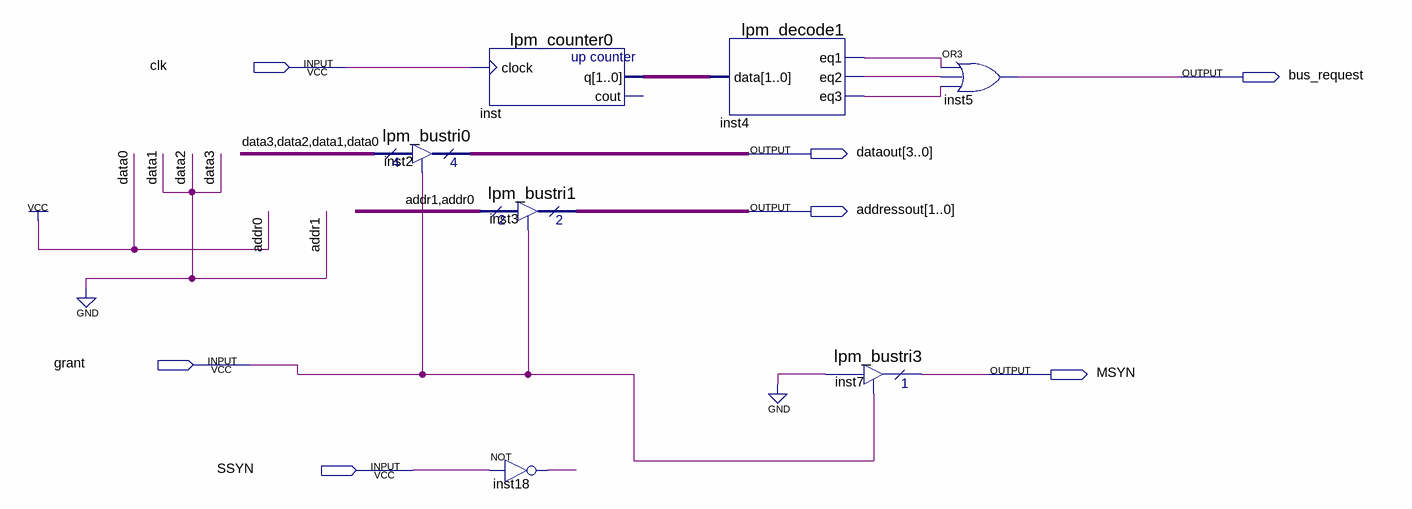
[diagram p0: schematic sheet]
// Quartus schematic master1.bdf as structural Verilog: 7 symbols, 7 pins
module master1 (
  input  clk,
  input  grant,
  input  SSYN,
  output bus_request,
  output [3:0] dataout,
  output [1:0] addressout,
  output MSYN
);

  wire inst4_eq1, inst4_eq2, inst4_eq3, inst18_out;
  wire [1:0] inst_q;

  lpm_bustri0 inst2 (.enabledt(grant), .data(4'b0001), .tridata(dataout));
  lpm_counter0 inst (.clock(clk), .q(inst_q));  // open: cout
  lpm_bustri1 inst3 (.enabledt(grant), .data(2'b01), .tridata(addressout));
  not inst18 (inst18_out, SSYN);
  lpm_decode1 inst4 (.data(inst_q), .eq1(inst4_eq1), .eq2(inst4_eq2), .eq3(inst4_eq3));
  lpm_bustri3 inst7 (.enabledt(grant), .data(1'b0), .tridata(MSYN));
  or inst5 (bus_request, inst4_eq1, inst4_eq2, inst4_eq3);
endmodule
